# Altium schematic sheet fpga-bank7.SchDoc: FPGA - Bank 7
size Legal; CheckedBy: J. Brinton; CompanyName: Signal Laboratories, Inc.; DrawnBy: J. Brinton; Engineer: J. Brinton; Address1: 3479 Edison Way; Address2: Menlo Park CA 94025; Address3: +1 (877) 778-8435; Address4: siglabs.com; DocumentNumber: 33; Revision: 2b; SheetNumber: 34; SheetTotal: 58
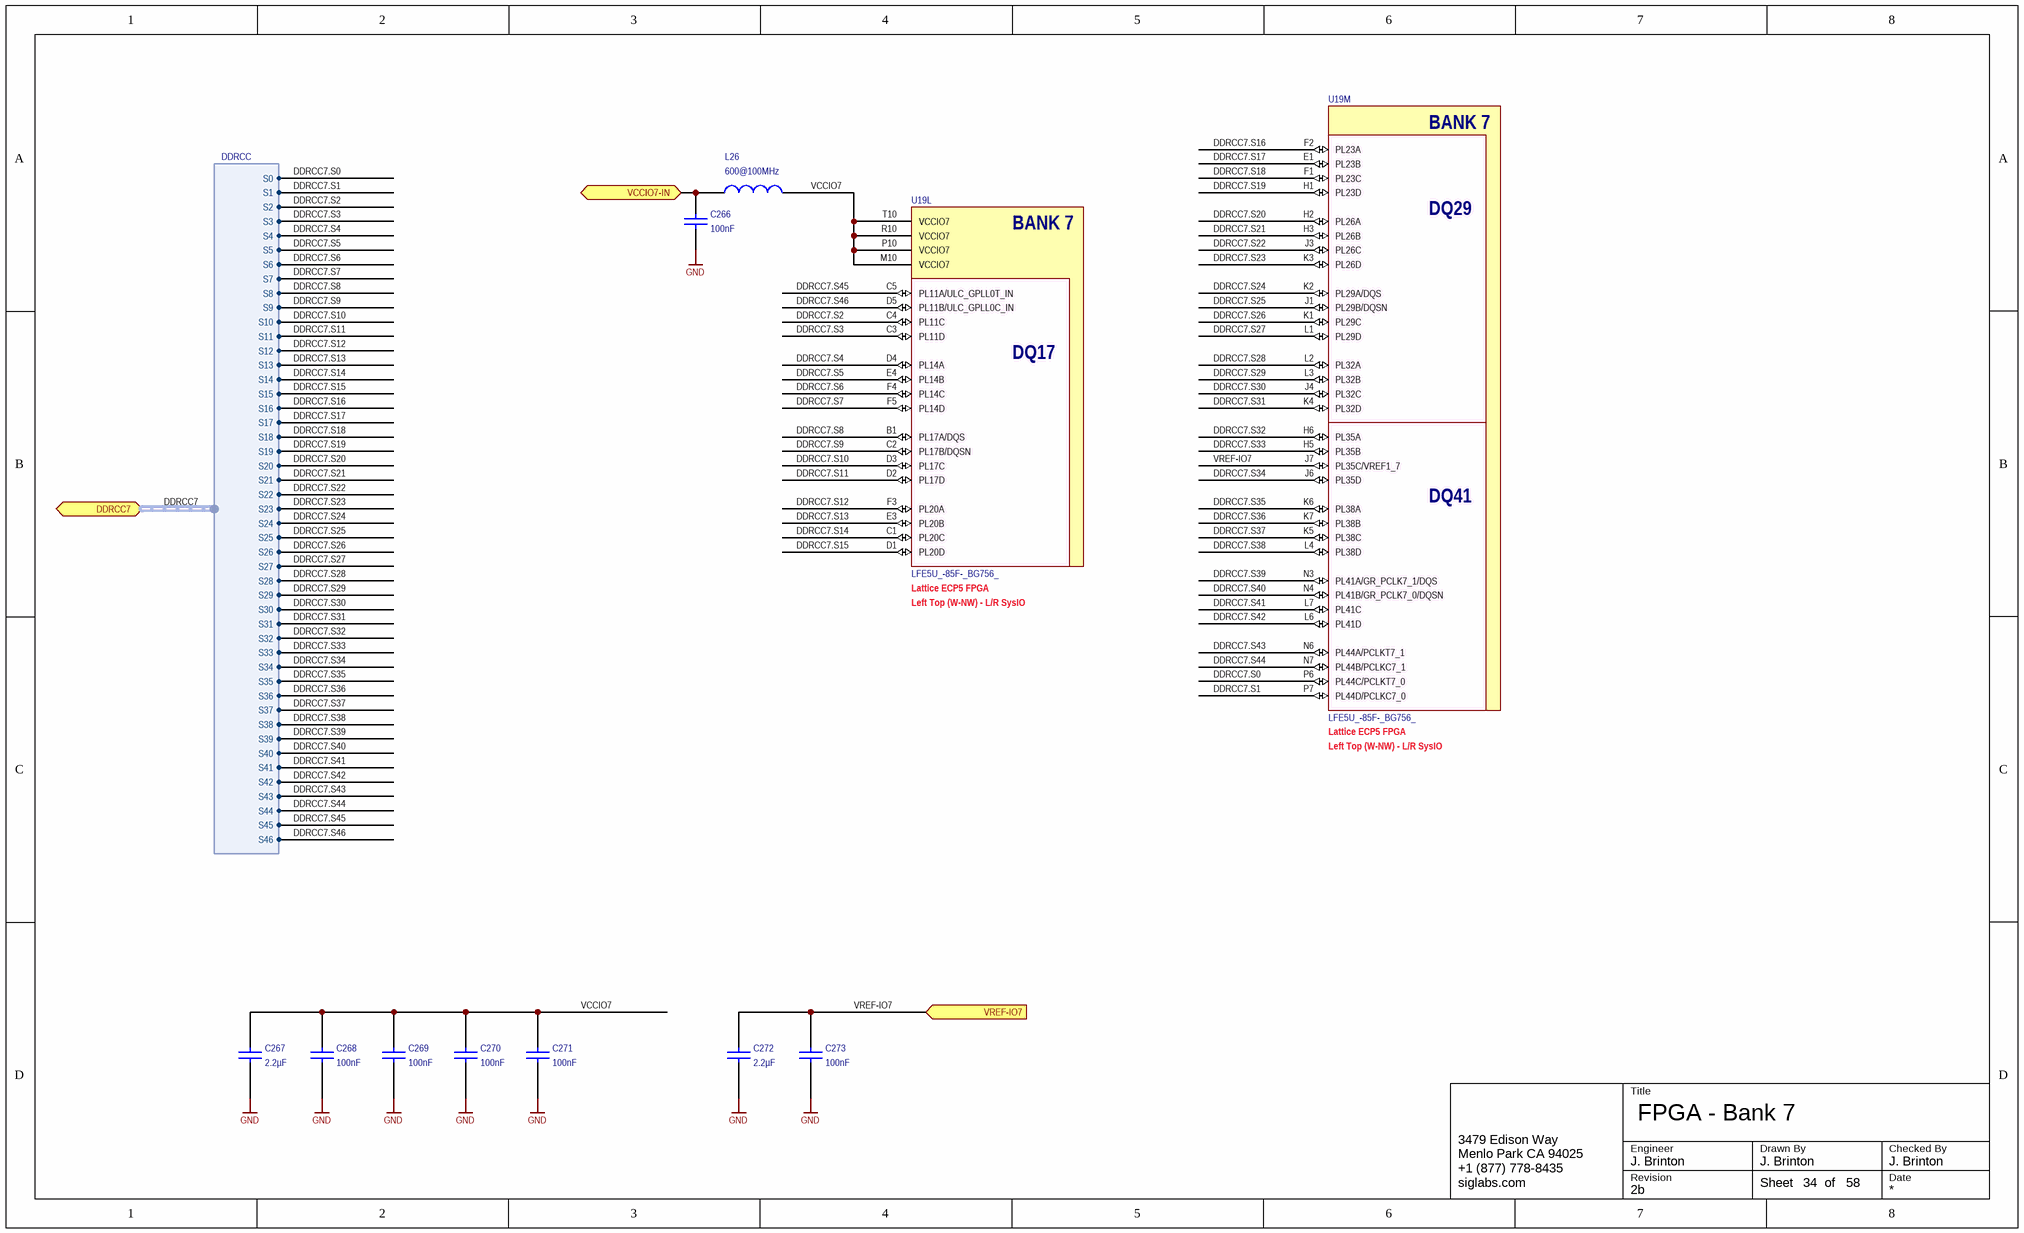
[diagram p0: fpga-bank7.SchDoc]

## Parts
C266  value 100nF  [CAPC1005X56N]  (hidden comment: GRM155R71C104KA88J)
C267  value 2.2µF  [CAPC1608X90N]  (hidden comment: GRM21BR71C225KA12L)
C268  value 100nF  [CAPC1005X56N]  (hidden comment: GRM155R71C104KA88J)
C269  value 100nF  [CAPC1005X56N]  (hidden comment: GRM155R71C104KA88J)
C270  value 100nF  [CAPC1005X56N]  (hidden comment: GRM155R71C104KA88J)
C271  value 100nF  [CAPC1005X56N]  (hidden comment: GRM155R71C104KA88J)
C272  value 2.2µF  [CAPC1608X90N]  (hidden comment: GRM21BR71C225KA12L)
C273  value 100nF  [CAPC1005X56N]  (hidden comment: GRM155R71C104KA88J)
L26  value 600@100MHz  [0402]  (hidden comment: BLM15PX601SN1D)
U19  LFE5U_-85F-_BG756_  [caBGA756]  (parts L,M of 19)

## Ports
DDRCC7 (harness DDRCC), VCCIO7-IN, VREF-IO7 (in)

## Harnesses
DDRCC: S0, S1, S2, S3, S4, S5, S6, S7, S8, S9, S10, S11, S12, S13, S14, S15, S16, S17, S18, S19, S20, S21, S22, S23, S24, S25, S26, S27, S28, S29, S30, S31, S32, S33, S34, S35, S36, S37, S38, S39, S40, S41, S42, S43, S44, S45, S46

## Nets
GND: C266.1 C267.1 C268.1 C269.1 C270.1 C271.1 C272.1 C273.1
DDRCC7.S0: U19.P6(PL44C/PCLKT7_0) ; port DDRCC7.S0
DDRCC7.S1: U19.P7(PL44D/PCLKC7_0) ; port DDRCC7.S1
DDRCC7.S2: U19.C4(PL11C) ; port DDRCC7.S2
DDRCC7.S3: U19.C3(PL11D) ; port DDRCC7.S3
DDRCC7.S4: U19.D4(PL14A) ; port DDRCC7.S4
DDRCC7.S5: U19.E4(PL14B) ; port DDRCC7.S5
DDRCC7.S6: U19.F4(PL14C) ; port DDRCC7.S6
DDRCC7.S7: U19.F5(PL14D) ; port DDRCC7.S7
DDRCC7.S8: U19.B1(PL17A/DQS) ; port DDRCC7.S8
DDRCC7.S9: U19.C2(PL17B/DQSN) ; port DDRCC7.S9
DDRCC7.S10: U19.D3(PL17C) ; port DDRCC7.S10
DDRCC7.S11: U19.D2(PL17D) ; port DDRCC7.S11
DDRCC7.S12: U19.F3(PL20A) ; port DDRCC7.S12
DDRCC7.S13: U19.E3(PL20B) ; port DDRCC7.S13
DDRCC7.S14: U19.C1(PL20C) ; port DDRCC7.S14
DDRCC7.S15: U19.D1(PL20D) ; port DDRCC7.S15
DDRCC7.S16: U19.F2(PL23A) ; port DDRCC7.S16
DDRCC7.S17: U19.E1(PL23B) ; port DDRCC7.S17
DDRCC7.S18: U19.F1(PL23C) ; port DDRCC7.S18
DDRCC7.S19: U19.H1(PL23D) ; port DDRCC7.S19
DDRCC7.S20: U19.H2(PL26A) ; port DDRCC7.S20
DDRCC7.S21: U19.H3(PL26B) ; port DDRCC7.S21
DDRCC7.S22: U19.J3(PL26C) ; port DDRCC7.S22
DDRCC7.S23: U19.K3(PL26D) ; port DDRCC7.S23
DDRCC7.S24: U19.K2(PL29A/DQS) ; port DDRCC7.S24
DDRCC7.S25: U19.J1(PL29B/DQSN) ; port DDRCC7.S25
DDRCC7.S26: U19.K1(PL29C) ; port DDRCC7.S26
DDRCC7.S27: U19.L1(PL29D) ; port DDRCC7.S27
DDRCC7.S28: U19.L2(PL32A) ; port DDRCC7.S28
DDRCC7.S29: U19.L3(PL32B) ; port DDRCC7.S29
DDRCC7.S30: U19.J4(PL32C) ; port DDRCC7.S30
DDRCC7.S31: U19.K4(PL32D) ; port DDRCC7.S31
DDRCC7.S32: U19.H6(PL35A) ; port DDRCC7.S32
DDRCC7.S33: U19.H5(PL35B) ; port DDRCC7.S33
DDRCC7.S34: U19.J6(PL35D) ; port DDRCC7.S34
DDRCC7.S35: U19.K6(PL38A) ; port DDRCC7.S35
DDRCC7.S36: U19.K7(PL38B) ; port DDRCC7.S36
DDRCC7.S37: U19.K5(PL38C) ; port DDRCC7.S37
DDRCC7.S38: U19.L4(PL38D) ; port DDRCC7.S38
DDRCC7.S39: U19.N3(PL41A/GR_PCLK7_1/DQS) ; port DDRCC7.S39
DDRCC7.S40: U19.N4(PL41B/GR_PCLK7_0/DQSN) ; port DDRCC7.S40
DDRCC7.S41: U19.L7(PL41C) ; port DDRCC7.S41
DDRCC7.S42: U19.L6(PL41D) ; port DDRCC7.S42
DDRCC7.S43: U19.N6(PL44A/PCLKT7_1) ; port DDRCC7.S43
DDRCC7.S44: U19.N7(PL44B/PCLKC7_1) ; port DDRCC7.S44
DDRCC7.S45: U19.C5(PL11A/ULC_GPLL0T_IN) ; port DDRCC7.S45
DDRCC7.S46: U19.D5(PL11B/ULC_GPLL0C_IN) ; port DDRCC7.S46
VCCIO7: C267.2 C268.2 C269.2 C270.2 C271.2 L26.1 U19.M10(VCCIO7) U19.P10(VCCIO7) U19.R10(VCCIO7) U19.T10(VCCIO7)
VCCIO7-IN: C266.2 L26.2 ; port VCCIO7-IN
VREF-IO7: C272.2 C273.2 U19.J7(PL35C/VREF1_7) ; port VREF-IO7

## Buses and harness runs
harness DDRCC7 = port DDRCC7

## Notes on the sheet
- (near U19) Left Top (W-NW) - L/R SysIO
- (near U19) Lattice ECP5 FPGA
- Title
- Engineer
- Revision
- Drawn By
- Checked By
- Date
- Sheet
- of
- (in symbol LFE5U_-85F-_BG756_, part L) BANK 7; DQ17
- (in symbol LFE5U_-85F-_BG756_, part M) BANK 7; DQ29; DQ41

## Library data of the parts
C266 C268-C271 C273 = GRM155R71A104KA01J: Ceramic Capacitor 100nF ±10% 16V X7R 0402; Manufacturer: Murata; Tr: -55:125; Manufacturer P/N: GRM155R71C104KA88J; Tolerance: ±10%; Package: 0402; Voltage: 16V
C267 C272 = GRM188R71A225KE15D: Ceramic Capacitor 2.2uF ±10% 10V X7R 0603; Manufacturer: Murata; Tr: -55:125; Manufacturer P/N: GRM188R71A225KE15D; Tolerance: ±10%; Package: 0603; Voltage: 10V
L26 = IND 0402: Ferrite Bead 600-Ohm @ 100MHz 900mA 0402; Manufacturer: Murata; Tolerance: ±25%; Tr: -55:125; Manufacturer P/N: BLM15PX601SN1D; Package: 0402
U19 = LFE5U_-85F-_BG756_: ECP5 FPGA, 85k LUT, 756-caBGA; Manufacturer: Lattice Semiconductor; Manufacturer P/N: LFE5U_-85F-_BG756_